# Altium project QuadroRiser.PrjPCB
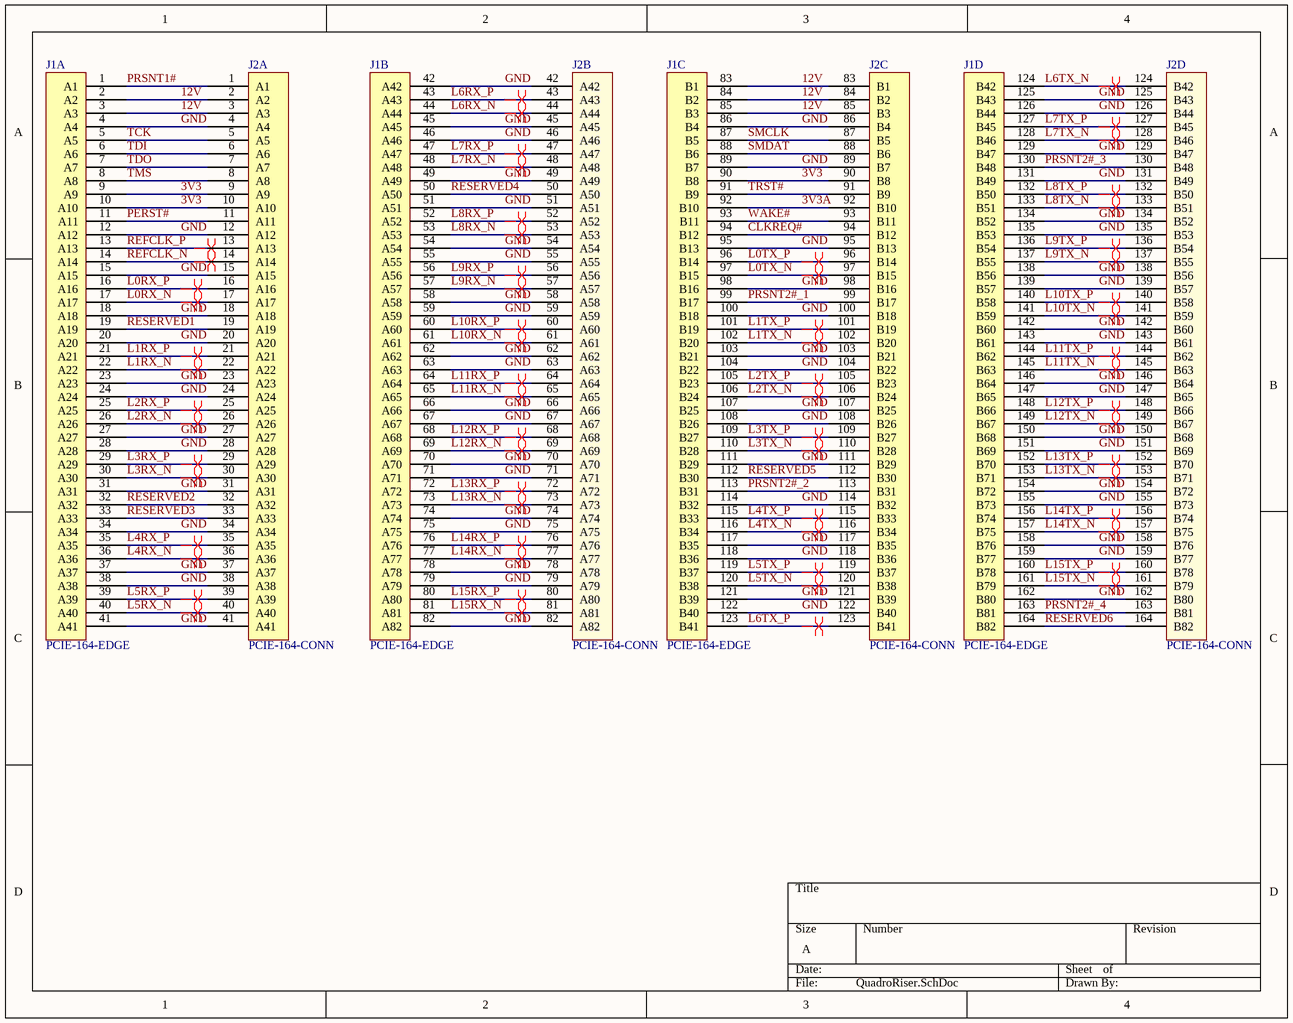
[diagram p0: QuadroRiser.SchDoc]
1 sheet, 2 parts. Net scope: global (net labels, ports and power ports of the same name join across sheets).
Board file: QuadroRiser.PcbDoc

## Sheet QuadroRiser.SchDoc
size A

### Parts
J1  PCIE-164-EDGE  [PCIE-164-EDGE]  (parts A,B,C,D of 4)
J2  PCIE-164-CONN  [PCIe-164-CONN]  (parts A,B,C,D of 4)

### Nets
3V3: J1.9(A9) J1.10(A10) J1.90(B8) J2.9(A9) J2.10(A10) J2.90(B8)
3V3A: J1.92(B10) J2.92(B10)
12V: J1.2(A2) J1.3(A3) J1.83(B1) J1.84(B2) J1.85(B3) J2.2(A2) J2.3(A3) J2.83(B1) J2.84(B2) J2.85(B3)
CLKREQ#: J1.94(B12) J2.94(B12)
GND: J1.4(A4) J1.12(A12) J1.15(A15) J1.18(A18) J1.20(A20) J1.23(A23) J1.24(A24) J1.27(A27) J1.28(A28) J1.31(A31) J1.34(A34) J1.37(A37) J1.38(A38) J1.41(A41) J1.42(A42) J1.45(A45) J1.46(A46) J1.49(A49) J1.51(A51) J1.54(A54) J1.55(A55) J1.58(A58) J1.59(A59) J1.62(A62) J1.63(A63) J1.66(A66) J1.67(A67) J1.70(A70) J1.71(A71) J1.74(A74) J1.75(A75) J1.78(A78) J1.79(A79) J1.82(A82) J1.86(B4) J1.89(B7) J1.95(B13) J1.98(B16) J1.100(B18) J1.103(B21) J1.104(B22) J1.107(B25) J1.108(B26) J1.111(B29) J1.114(B32) J1.117(B35) J1.118(B36) J1.121(B39) J1.122(B40) J1.125(B43) J1.126(B44) J1.129(B47) J1.131(B49) J1.134(B52) J1.135(B53) J1.138(B56) J1.139(B57) J1.142(B60) J1.143(B61) J1.146(B64) J1.147(B65) J1.150(B68) J1.151(B69) J1.154(B72) J1.155(B73) J1.158(B76) J1.159(B77) J1.162(B80) J2.4(A4) J2.12(A12) J2.15(A15) J2.18(A18) J2.20(A20) J2.23(A23) J2.24(A24) J2.27(A27) J2.28(A28) J2.31(A31) J2.34(A34) J2.37(A37) J2.38(A38) J2.41(A41) J2.42(A42) J2.45(A45) J2.46(A46) J2.49(A49) J2.51(A51) J2.54(A54) J2.55(A55) J2.58(A58) J2.59(A59) J2.62(A62) J2.63(A63) J2.66(A66) J2.67(A67) J2.70(A70) J2.71(A71) J2.74(A74) J2.75(A75) J2.78(A78) J2.79(A79) J2.82(A82) J2.86(B4) J2.89(B7) J2.95(B13) J2.98(B16) J2.100(B18) J2.103(B21) J2.104(B22) J2.107(B25) J2.108(B26) J2.111(B29) J2.114(B32) J2.117(B35) J2.118(B36) J2.121(B39) J2.122(B40) J2.125(B43) J2.126(B44) J2.129(B47) J2.131(B49) J2.134(B52) J2.135(B53) J2.138(B56) J2.139(B57) J2.142(B60) J2.143(B61) J2.146(B64) J2.147(B65) J2.150(B68) J2.151(B69) J2.154(B72) J2.155(B73) J2.158(B76) J2.159(B77) J2.162(B80)
L0RX_N: J1.17(A17) J2.17(A17)
L0RX_P: J1.16(A16) J2.16(A16)
L0TX_N: J1.97(B15) J2.97(B15)
L0TX_P: J1.96(B14) J2.96(B14)
L1RX_N: J1.22(A22) J2.22(A22)
L1RX_P: J1.21(A21) J2.21(A21)
L1TX_N: J1.102(B20) J2.102(B20)
L1TX_P: J1.101(B19) J2.101(B19)
L2RX_N: J1.26(A26) J2.26(A26)
L2RX_P: J1.25(A25) J2.25(A25)
L2TX_N: J1.106(B24) J2.106(B24)
L2TX_P: J1.105(B23) J2.105(B23)
L3RX_N: J1.30(A30) J2.30(A30)
L3RX_P: J1.29(A29) J2.29(A29)
L3TX_N: J1.110(B28) J2.110(B28)
L3TX_P: J1.109(B27) J2.109(B27)
L4RX_N: J1.36(A36) J2.36(A36)
L4RX_P: J1.35(A35) J2.35(A35)
L4TX_N: J1.116(B34) J2.116(B34)
L4TX_P: J1.115(B33) J2.115(B33)
L5RX_N: J1.40(A40) J2.40(A40)
L5RX_P: J1.39(A39) J2.39(A39)
L5TX_N: J1.120(B38) J2.120(B38)
L5TX_P: J1.119(B37) J2.119(B37)
L6RX_N: J1.44(A44) J2.44(A44)
L6RX_P: J1.43(A43) J2.43(A43)
L6TX_N: J1.124(B42) J2.124(B42)
L6TX_P: J1.123(B41) J2.123(B41)
L7RX_N: J1.48(A48) J2.48(A48)
L7RX_P: J1.47(A47) J2.47(A47)
L7TX_N: J1.128(B46) J2.128(B46)
L7TX_P: J1.127(B45) J2.127(B45)
L8RX_N: J1.53(A53) J2.53(A53)
L8RX_P: J1.52(A52) J2.52(A52)
L8TX_N: J1.133(B51) J2.133(B51)
L8TX_P: J1.132(B50) J2.132(B50)
L9RX_N: J1.57(A57) J2.57(A57)
L9RX_P: J1.56(A56) J2.56(A56)
L9TX_N: J1.137(B55) J2.137(B55)
L9TX_P: J1.136(B54) J2.136(B54)
L10RX_N: J1.61(A61) J2.61(A61)
L10RX_P: J1.60(A60) J2.60(A60)
L10TX_N: J1.141(B59) J2.141(B59)
L10TX_P: J1.140(B58) J2.140(B58)
L11RX_N: J1.65(A65) J2.65(A65)
L11RX_P: J1.64(A64) J2.64(A64)
L11TX_N: J1.145(B63) J2.145(B63)
L11TX_P: J1.144(B62) J2.144(B62)
L12RX_N: J1.69(A69) J2.69(A69)
L12RX_P: J1.68(A68) J2.68(A68)
L12TX_N: J1.149(B67) J2.149(B67)
L12TX_P: J1.148(B66) J2.148(B66)
L13RX_N: J1.73(A73) J2.73(A73)
L13RX_P: J1.72(A72) J2.72(A72)
L13TX_N: J1.153(B71) J2.153(B71)
L13TX_P: J1.152(B70) J2.152(B70)
L14RX_N: J1.77(A77) J2.77(A77)
L14RX_P: J1.76(A76) J2.76(A76)
L14TX_N: J1.157(B75) J2.157(B75)
L14TX_P: J1.156(B74) J2.156(B74)
L15RX_N: J1.81(A81) J2.81(A81)
L15RX_P: J1.80(A80) J2.80(A80)
L15TX_N: J1.161(B79) J2.161(B79)
L15TX_P: J1.160(B78) J2.160(B78)
PERST#: J1.11(A11) J2.11(A11)
PRSNT1#: J1.1(A1) J2.1(A1)
PRSNT2#_1: J1.99(B17) J2.99(B17)
PRSNT2#_2: J1.113(B31) J2.113(B31)
PRSNT2#_3: J1.130(B48) J2.130(B48)
PRSNT2#_4: J1.163(B81) J2.163(B81)
REFCLK_N: J1.14(A14) J2.14(A14)
REFCLK_P: J1.13(A13) J2.13(A13)
RESERVED1: J1.19(A19) J2.19(A19)
RESERVED2: J1.32(A32) J2.32(A32)
RESERVED3: J1.33(A33) J2.33(A33)
RESERVED4: J1.50(A50) J2.50(A50)
RESERVED5: J1.112(B30) J2.112(B30)
RESERVED6: J1.164(B82) J2.164(B82)
SMCLK: J1.87(B5) J2.87(B5)
SMDAT: J1.88(B6) J2.88(B6)
TCK: J1.5(A5) J2.5(A5)
TDI: J1.6(A6) J2.6(A6)
TDO: J1.7(A7) J2.7(A7)
TMS: J1.8(A8) J2.8(A8)
TRST#: J1.91(B9) J2.91(B9)
WAKE#: J1.93(B11) J2.93(B11)

### Layout directives
differential pair: L0RX_N, L0RX_P, L0TX_N, L0TX_P, L1RX_N, L1RX_P, L1TX_N, L1TX_P, L2RX_N, L2RX_P, L2TX_N, L2TX_P, L3RX_N, L3RX_P, L3TX_N, L3TX_P, L4RX_N, L4RX_P, L4TX_N, L4TX_P, L5RX_N, L5RX_P, L5TX_N, L5TX_P, L6RX_N, L6RX_P, L6TX_N, L6TX_P, L7RX_N, L7RX_P, L7TX_N, L7TX_P, L8RX_N, L8RX_P, L8TX_N, L8TX_P, L9RX_N, L9RX_P, L9TX_N, L9TX_P, L10RX_N, L10RX_P, L10TX_N, L10TX_P, L11RX_N, L11RX_P, L11TX_N, L11TX_P, L12RX_N, L12RX_P, L12TX_N, L12TX_P, L13RX_N, L13RX_P, L13TX_N, L13TX_P, L14RX_N, L14RX_P, L14TX_N, L14TX_P, L15RX_N, L15RX_P, L15TX_N, L15TX_P, REFCLK_N, REFCLK_P

### Library data of the parts
J1 = PCIE-164-EDGE: PCIe x16 Edge Connector pad layout
J2 = PCIE-164-CONN: CONN PCI EXP FEMALE 164POS 0.039; Supplier 1: Digi-Key; Supplier Part Number 1: WM9003-ND